# Altium schematic sheet OC_PROT_with_5V.SchDoc
size C; SheetNumber: 2; SheetTotal: 7
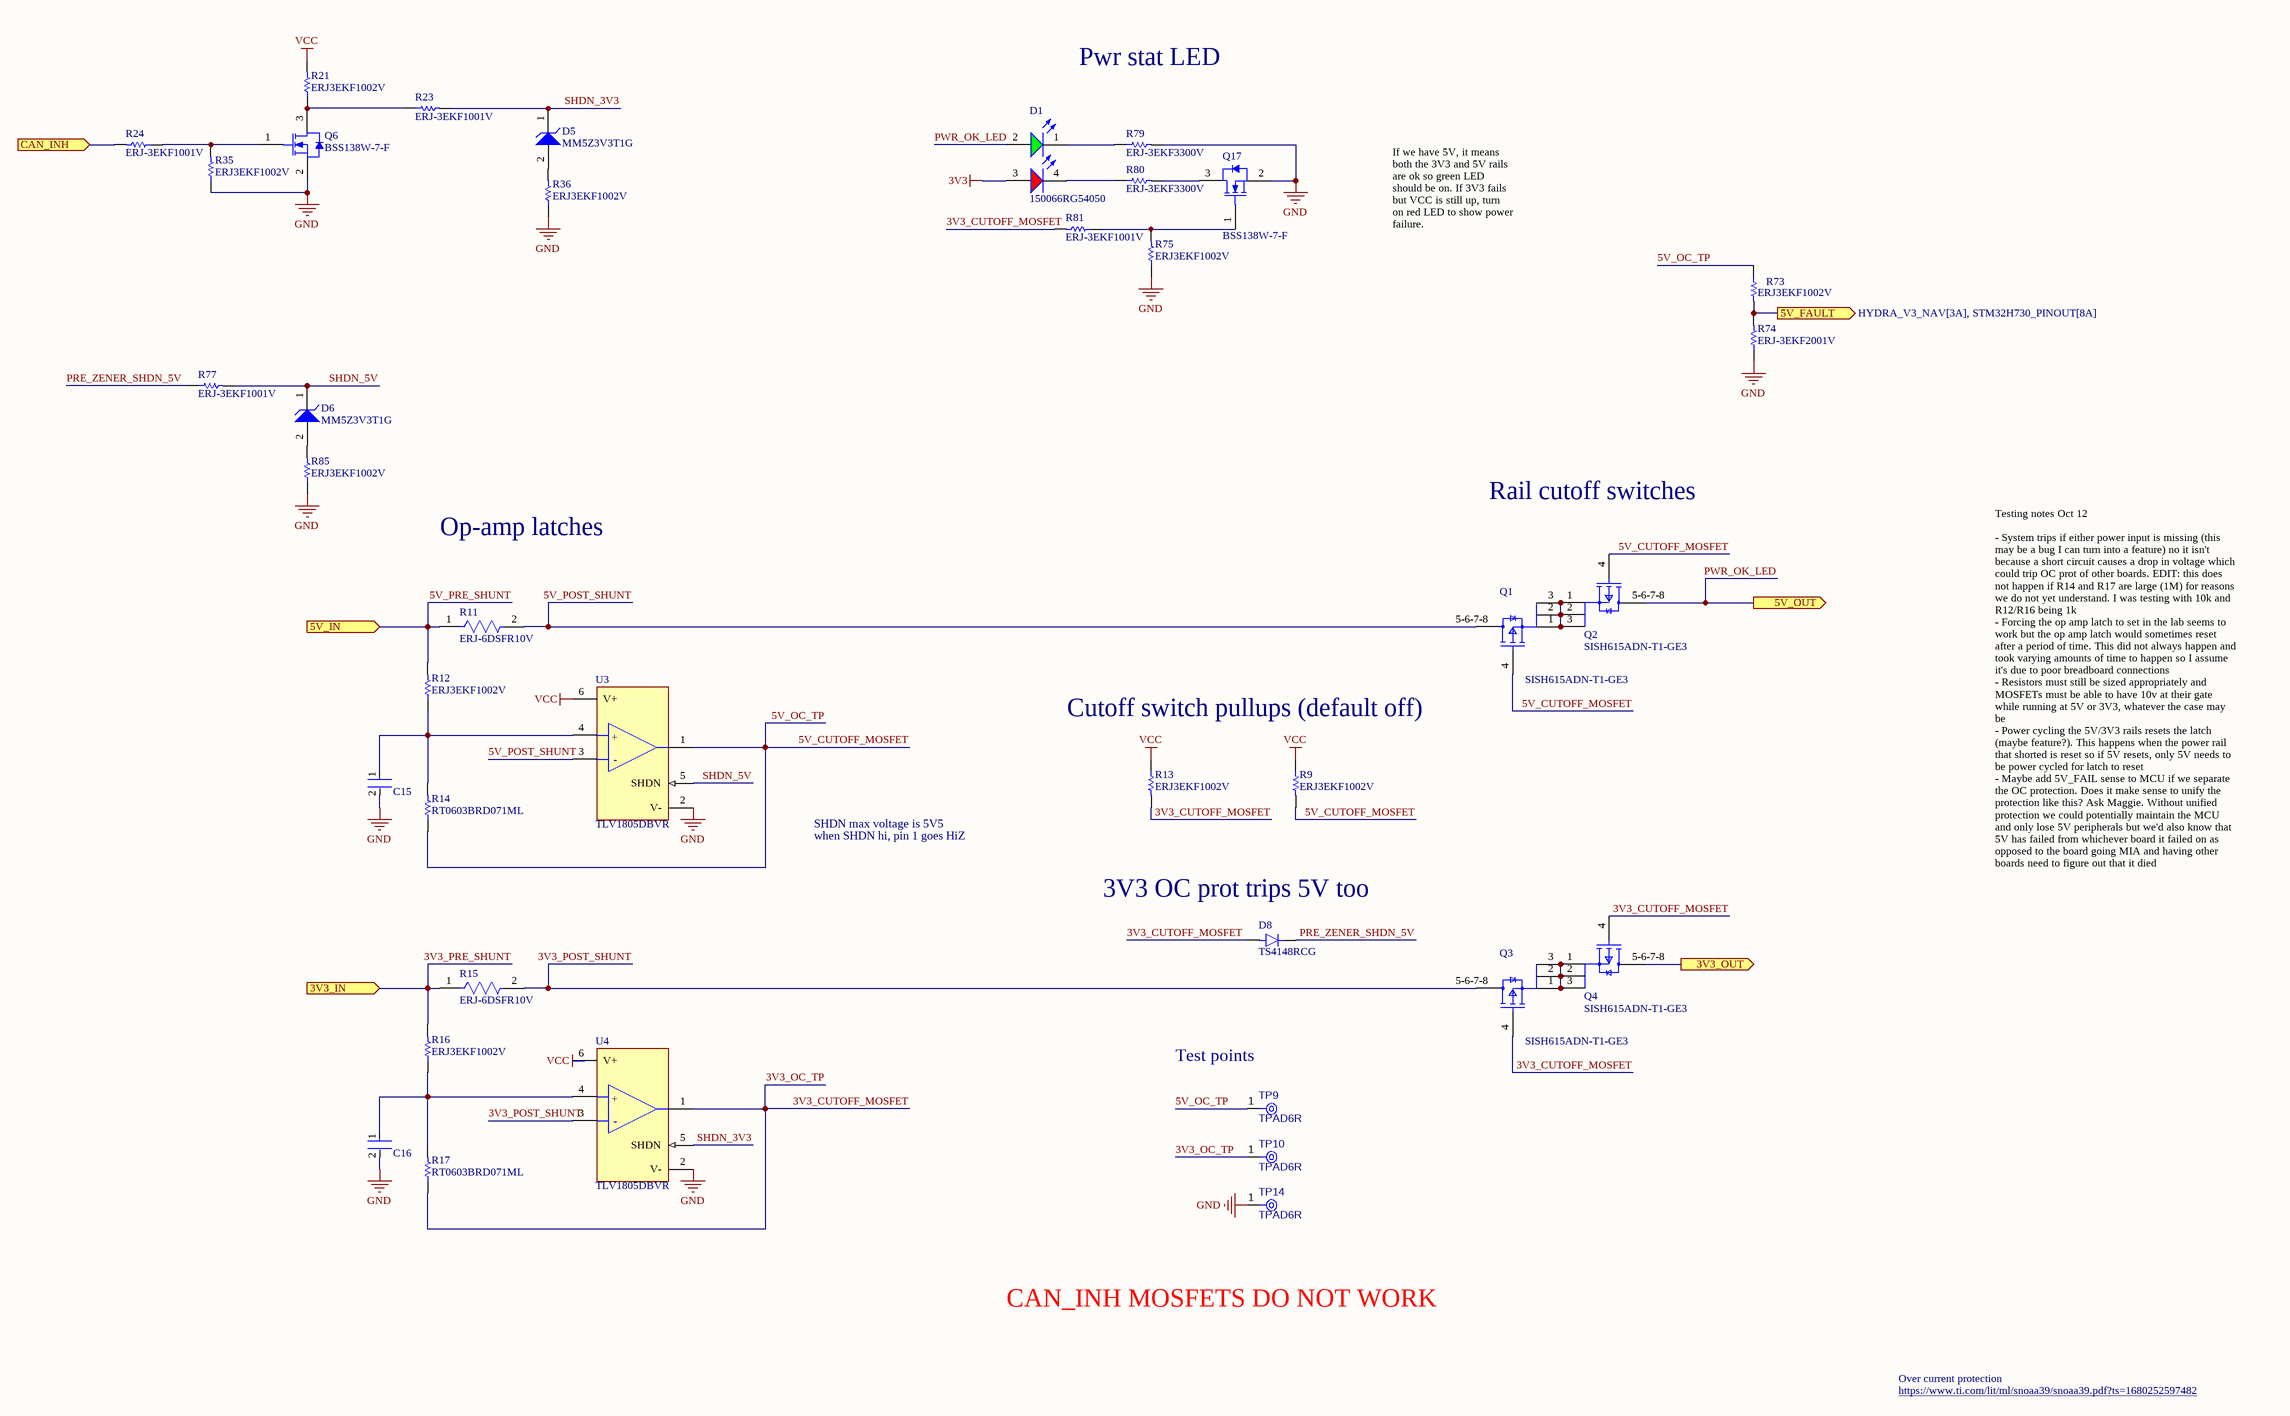
[diagram p0: OC_PROT_with_5V.SchDoc]

## Parts
C15  C0402C104K8PACTU  [FP-C0402-BB-MFG]  (value not drawn)
C16  C0402C104K8PACTU  [FP-C0402-BB-MFG]  (value not drawn)
D1  150066RG54050  [WL-SBCD_0606]
D5  MM5Z3V3T1G  [ONSC-SOD-523-2-502-01_V]
D6  MM5Z3V3T1G  [ONSC-SOD-523-2-502-01_V]
D8  TS4148RCG  [TS4148RCG-Footprint-1]
Q1  SISH615ADN-T1-GE3  [SISH615ADN-T1-GE3-Footprint-1]
Q2  SISH615ADN-T1-GE3  [SISH615ADN-T1-GE3-Footprint-1]
Q3  SISH615ADN-T1-GE3  [SISH615ADN-T1-GE3-Footprint-1]
Q4  SISH615ADN-T1-GE3  [SISH615ADN-T1-GE3-Footprint-1]
Q6  BSS138W-7-F  [DIOD-SOT323-3_V]
Q17  BSS138W-7-F  [DIOD-SOT323-3_V]
R9  ERJ3EKF1002V  [RESC1609X55X30LL15T15]
R11  ERJ-6DSFR10V  [FP-ERJ6D-MFG]
R12  ERJ3EKF1002V  [RESC1609X55X30LL15T15]
R13  ERJ3EKF1002V  [RESC1609X55X30LL15T15]
R14  RT0603BRD071ML  [RESC1608X55X30NL20T20]
R15  ERJ-6DSFR10V  [FP-ERJ6D-MFG]
R16  ERJ3EKF1002V  [RESC1609X55X30LL15T15]
R17  RT0603BRD071ML  [RESC1608X55X30NL20T20]
R21  ERJ3EKF1002V  [RESC1609X55X30LL15T15]
R23  ERJ-3EKF1001V  [RESC1608X55X30LL15T15]
R24  ERJ-3EKF1001V  [RESC1608X55X30LL15T15]
R35  ERJ3EKF1002V  [RESC1609X55X30LL15T15]
R36  ERJ3EKF1002V  [RESC1609X55X30LL15T15]
R73  ERJ3EKF1002V  [RESC1609X55X30LL15T15]
R74  ERJ-3EKF2001V  [RESC1608X55X30ML15T15]
R75  ERJ3EKF1002V  [RESC1609X55X30LL15T15]
R77  ERJ-3EKF1001V  [RESC1608X55X30LL15T15]
R79  ERJ-3EKF3300V  [RESC1608X55X30LL15T15]
R80  ERJ-3EKF3300V  [RESC1608X55X30LL15T15]
R81  ERJ-3EKF1001V  [RESC1608X55X30LL15T15]
R85  ERJ3EKF1002V  [RESC1609X55X30LL15T15]
TP9  TPAD6R  [TP06R]  (no BOM)
TP10  TPAD6R  [TP06R]  (no BOM)
TP14  TPAD6R  [TP06R]  (no BOM)
U3  TLV1805DBVR  [FP-DBV0006A-IPC_C]
U4  TLV1805DBVR  [FP-DBV0006A-IPC_C]

## Ports
3V3_IN (in, see HYDRA_V3_NAV[3A]), 3V3_OUT (out, see HYDRA_V3_NAV[3A]), 5V_FAULT (out, see HYDRA_V3_NAV[3A], STM32H730_PINOUT[8A]), 5V_IN (in, see HYDRA_V3_NAV[3A]), 5V_OUT (out, see HYDRA_V3_NAV[3A]), CAN_INH (in, see HYDRA_V3_NAV[3A], STM32H730_PINOUT[8A])

## Nets
3V3: D1.3(A)
GND: C15.2 C16.2 Q6.2(S) Q17.2(S) R35.1 R36.1 R74.1 R75.1 R79.2 R85.1 TP14.1(TP) U3.2(V-) U4.2(V-)
VCC: R9.1 R13.1 R21.2 U3.6(V+) U4.6(V+)
3V3_CUTOFF_MOSFET: D8.A Q3.4(G) Q4.4(G) R13.2 R17.1 R81.2 TP10.1(TP) U4.1(OUT)  [also labelled 3V3_OC_TP]
3V3_OUT: Q4.5-6-7-8(D) ; port 3V3_OUT
3V3_POST_SHUNT: Q3.5-6-7-8(D) R15.2 U4.3(-IN)
3V3_PRE_SHUNT: R15.1 R16.2 ; port 3V3_IN
5V_CUTOFF_MOSFET: Q1.4(G) Q2.4(G) R9.2 R14.1 R73.1 TP9.1(TP) U3.1(OUT)  [also labelled 5V_OC_TP]
5V_FAULT: R73.2 R74.2 ; port 5V_FAULT
5V_POST_SHUNT: Q1.5-6-7-8(D) R11.2 U3.3(-IN)
5V_PRE_SHUNT: R11.1 R12.2 ; port 5V_IN
CAN_INH: R24.2 ; port CAN_INH
PRE_ZENER_SHDN_5V: D8.C(K) R77.1
PWR_OK_LED: D1.2(A) Q2.5-6-7-8(D) ; port 5V_OUT
SHDN_3V3: D5.1(K) R23.2 U4.5(SHDN)
SHDN_5V: D6.1(K) R77.2 U3.5(SHDN)
NetC15_1: C15.1 R12.1 R14.2 U3.4(+IN)
NetC16_1: C16.1 R16.1 R17.2 U4.4(+IN)
NetD1_1: D1.1(K) R79.1
NetD1_4: D1.4(K) R80.1
NetD5_2: D5.2(A) R36.2
NetD6_2: D6.2(A) R85.2
NetQ1_1: Q1.1(S) Q1.2(S) Q1.3(S) Q2.1(S) Q2.2(S) Q2.3(S)
NetQ3_1: Q3.1(S) Q3.2(S) Q3.3(S) Q4.1(S) Q4.2(S) Q4.3(S)
NetQ6_1: Q6.1(G) R24.1 R35.2
NetQ6_3: Q6.3(D) R21.1 R23.1
NetQ17_1: Q17.1(G) R75.2 R81.1
NetQ17_3: Q17.3(D) R80.2

## Notes on the sheet
- Pwr stat LED
- If we have 5V, it means both the 3V3 and 5V rails are ok so green LED should be on. If 3V3 fails but VCC is still up, turn on red LED to show power failure.
- Rail cutoff switches
- Op-amp latches
- Cutoff switch pullups (default off)
- SHDN max voltage is 5V5
- when SHDN hi, pin 1 goes HiZ
- (near D8) 3V3 OC prot trips 5V too
- Testing notes Oct 12
  - System trips if either power input is missing (this may be a bug I can turn into a feature) no it isn't because a short circuit causes a drop in voltage which could trip OC prot of other boards. EDIT: this does not happen if R14 and R17 are large (1M) for reasons we do not yet understand. I was testing with 10k and R12/R16 being 1k
  - Forcing the op amp latch to set in the lab seems to work but the op amp latch would sometimes reset after a period of time. This did not always happen and took varying amounts of time to happen so I assume it's due to poor breadboard connections
  - Resistors must still be sized appropriately and MOSFETs must be able to have 10v at their gate while running at 5V or 3V3, whatever the case may be
  - Power cycling the 5V/3V3 rails resets the latch (maybe feature?). This happens when the power rail that shorted is reset so if 5V resets, only 5V needs to be power cycled for latch to reset
  - Maybe add 5V_FAIL sense to MCU if we separate the OC protection. Does it make sense to unify the protection like this? Ask Maggie. Without unified protection we could potentially maintain the MCU and only lose 5V peripherals but we'd also know that 5V has failed from whichever board it failed on as opposed to the board going MIA and having other boards need to figure out that it died
- (near TP9) Test points
- CAN_INH MOSFETS DO NOT WORK
- https://www.ti.com/lit/ml/snoaa39/snoaa39.pdf?ts=1680252597482
- Over current protection
- (in symbol CMP-04896-000098-1) +; -

## Library data of the parts
C15 C16 = CMP-2008-02046-2: CAP CER 0.1UF 10V X5R 0402; Manufacturer: Kemet; Material: Ceramic; Capacitance: 0.10 μF; Temperature Coefficient: 15%; Tolerance: 0.1; Value: 0.10 μF; Package: C0402-BB; Temperature: -55°C to +125°C; ComponentLink2Description: Datasheet; Temperature Characteristic: X5R; Device Class L1: Passive Components; Height: 0.55mm; Lead Free: Yes; ComponentLink2URL: https://content.kemet.com/datasheets/KEM_C1002_X7R_SMD.pdf; Device Class L2: Capacitors; Temperature Range Low: -55°C; Temperature Range High: +125°C; RoHS: TRUE; Octopart: https://octopart.com/c0402c104k8pactu-kemet-140039; Automotive: No; Mouser Description: Capacitor 100 nF 10 VDC 0402; Category: Cap; Voltage Rating: 10 V; Digikey Description: CAP CER 0.1UF 10V X5R 0402; Ipc Land Pattern Name: CAPC10050X50; Device Class L3: Ceramic Capacitors; Manufacturer Part Number: C0402C104K8PACTU
D1 = CMP-004-00040-2: Led, Red/Grn, 180Mcd/230Mcd, 624Nm/525Nm Rohs Compliant: Yes; Source: rgled.SchLib; Component Type: Standard; Design Item ID: CMP-004-00034-2; Pins: 4
D5 D6 = CMP-1060-00750-1: Zener Voltage Regulator, 500 mW, 2-Pin SOD-523, Pb-Free, Tape and Reel; Manufacturer: On Semiconductor; P Max (W): 0.5; VZ Typ (V): 3.3; RoHS: Pb-Free; ComponentLink2Description: Datasheet; PackageReference: SOD-523-2-502-01; DatasheetVersion: Rev. 10; ComponentLink1Description: Manufacturer URL; PackageVersion: Rev. E, 09/2010; ComponentLink3URL: http://www.onsemi.com/pub_link/Collateral/502-01.PDF; ComponentLink2URL: http://www.onsemi.cn/pub_link/Collateral/MM5Z2V4T1-D.PDF; Mounting Technology: Surface Mount; PartNumber: MM5Z3V3T1G; Packing: Tape and Reel; PackageDescription: 2-Pin SOD, Body 1.2 x 0.8 mm; ComponentLink1URL: http://www.onsemi.com/; ComponentLink3Description: Package Specification
D8 = CMP-004-00036-1: SMD Si-Diode 75V 100mA 0603
Q1-Q4 = CMP-013-00036-1: Trans MOSFET P-CH 20V 22.1A 8-Pin PowerPAK 1212 EP T/R
Q6 Q17 = CMP-2000-05968-1: N-Channel Enhancement Mode Mosfet, 50 V, 200 mA, -55 to 150 degC, 6-Pin SOT-323, RoHS, Tape and Reel; Typical Turn-Off Delay Time: 20ns; Number of Channels: 1Channel; Type: EnhancementModeFieldEffectTransistor; Brand: DiodesIncorporated; Vds - Drain-Source Breakdown Voltage: 75V; Vgs - Gate-Source Voltage: 20V; Rds On - Drain-Source Resistance: 1.4Ohms; Transistor Type: 1N-Channel; Configuration: Single; Unit Weight: 0.000212oz; Pd - Power Dissipation: 200mW; Id - Continuous Drain Current: 200mA; Forward Transconductance - Min: 0.1S; Manufacturer URL: http://www.diodes.com/; Series: BSS138; Package Description: 3-Pin Small Outline Transistor, Body 2 x 1.25 mm, Pitch 0.65 mm; Mounting Technology: SurfaceMount; Product Category: MOSFET; RoHS: True; Maximum Operating Temperature: +150C; Height: 1mm; Length: 2.2mm; Technology: Si; Width: 1.35mm; Datasheet URL: http://www.diodes.com/_files/datasheets/ds30206.pdf; Manufacturer: DiodesIncorporated; Package / Case: SOT-323-3; Typical Turn-On Delay Time: 20ns; Transistor Polarity: N-Channel; Factory Pack Quantity: 3000; Packaging: Reel; Product: MOSFETSmallSignal; Datasheet Version: Rev. 11-2, 09/2013; Package Reference: SOT323; Minimum Operating Temperature: -55C; Mounting Style: SMD/SMT; Channel Mode: Enhancement
R9 R12 R13 R16 R21 R35 R36 R73 R75 R85 = CMP-1012-00623-3: Chip Resistor, 10 KOhm, +/- 1%, 0.1 W, -55 to 155 degC, 0603 (1608 Metric), RoHS, Tape and Reel; Manufacturer: Panasonic; Voltage Rating: 75V; Case\/Package: 0603; Power Rating: 100mW; Resistance: 10KOhm; Temperature Coefficient: 100ppm\/degreesC; Number of Pins: 2; Package Reference: 603; Depth: 0.8mm; Mount: SurfaceMount; Package Description: 2-Pin Surface Mount Device, Body 1.6 x 0.85 mm; Datasheet Version: 02/2017; Length: 1.6mm; Lead Free: LeadFree; Height: 0.45mm; Number of Terminations: 2; Max Power Dissipation: 100mW; Min Operating Temperature: -55degC; Datasheet URL: https://industrial.panasonic.com/cdbs/www-data/pdf/RDA0000/AOA0000C304.pdf; Termination: SMD/SMT; Case Code (Metric): 1608; Case Code (Imperial): 0603; Tolerance: 1%; Max Operating Temperature: 155degC; RoHSCompliant: true; Voltage Rating (DC): 75V; Radiation Hardening: No; Packaging: TapeandReel; Composition: ThickFilm; Mounting Technology: SurfaceMount; Manufacturer URL: http://www.panasonic.com/; Width: 0.031inch; REACH SVHC: NoSVHC; Contact Plating: Tin; Military Standard: Not; Package Quantity: 1
R11 R15 = CMP-05422-000098-1: RES 0.1 OHM 1% 1/2W 0805; Temperature Coefficient: 150ppm/°C; Resistance: 100mR; Max Power Dissipation: 500mW; Tolerance: 1%; Length: 0.079inch; Features: Automotive AEC-Q200; Width: 0.049inch; Resistor Type: Thick Film; Case Code (Metric): 2012; Number of Terminations: 2; Max Operating Temperature: 155°C; Case/Package: 0805; Height: 0.028inch; Packaging: Cut Tape; Case Code (Imperial): 0805; Min Operating Temperature: -55°C
R14 R17 = CMP-2000-00925-1: NOT PANASONIC, THIS IS A 1M RESISTORhttps://www.yageo.com/upload/media/product/productsearch/datasheet/rchip/PYu-RT_1-to-0.01_RoHS_L_13.pdf; Part Number: ERA-3AEB163V; Manufacturer: Panasonic
R23 R24 R77 R81 = CMP-2000-00180-1: Manufacturer: Panasonic; Part Number: ERJ-3EKF1001V
R74 = CMP-2000-00317-1: Manufacturer: Panasonic; Part Number: ERJ-3EKF2001V
R79 R80 = CMP-2000-00435-2: Chip Resistor, 330 Ohm, +/- 1%, 0.1 W, -55 to 155 degC, 0603 (1608 Metric), RoHS, Tape and Reel; Gender: Male; Mating Cycles: 10000; Current Rating: 500 mA; Voltage Rating: 10 V; REACH SVHC: No SVHC; PackageDescription: 2-Pin Surface Mount Device, Body 1.6 x 0.85 mm; Contact Finish: Gold; Pins: 8; ComponentLink1Description: Manufacturer URL; Packaging: Tape and Reel; Max Operating Temperature: 85 degC; Contact Material: Copper; Height: 1.45 mm; Width: 1.45 mm; DatasheetVersion: Apr-15; Package Quantity: 1500; Contact Plating: Gold; PackageReference: 0603; Mount: Surface Mount; Lead Pitch: 1.1 mm; Min Operating Temperature: -25 degC; ComponentLink1URL: http://www.panasonic.com/; ComponentLink2URL: http://industrial.panasonic.com/cdbs/www-data/pdf/RDA0000/AOA0000C86.pdf; Length: 13.7 mm; ComponentLink2Description: Datasheet; RoHSCompliant: true
TP9 TP10 TP14 = CMP-00028-00002-2: 0.6mm round; Pins: 1
U3 U4 = CMP-04896-000098-1: 40V, RAIL-TO-RAIL INPUT, PUSH-PU